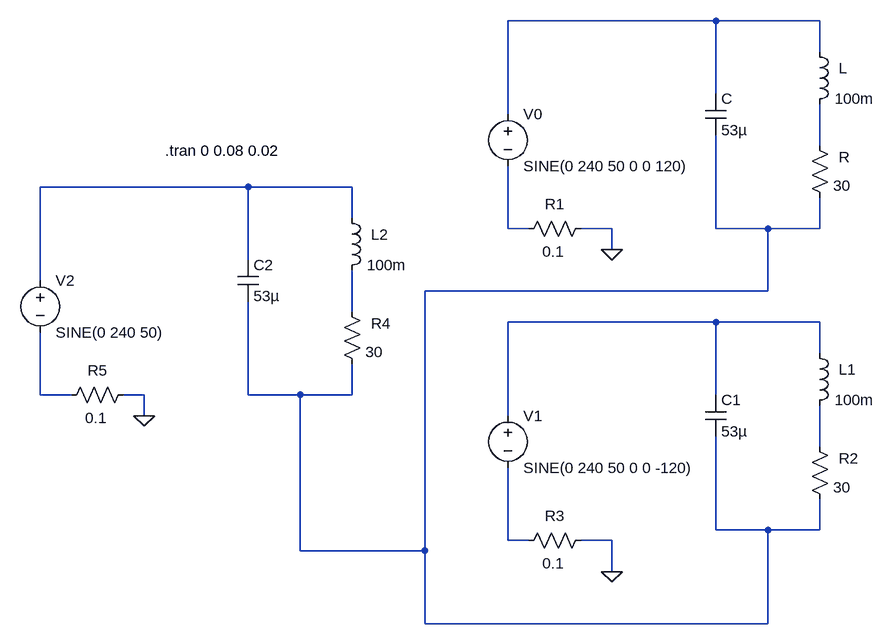
[diagram p0: schematic 3-phase_star_parallel_compensation_capacitor.asc]
3-phase_star_parallel_compensation_capacitor.asc, the LTspice schematic file:
Version 4
SHEET 1 1240 868
WIRE 384 -64 64 -64
WIRE 544 -64 384 -64
WIRE 544 -16 544 -64
WIRE 384 48 384 -64
WIRE 64 80 64 -64
WIRE 544 128 544 64
WIRE -336 192 -656 192
WIRE -176 192 -336 192
WIRE -176 240 -176 192
WIRE 64 256 64 160
WIRE 96 256 64 256
WIRE 224 256 176 256
WIRE 384 256 384 112
WIRE 464 256 384 256
WIRE 544 256 544 208
WIRE 544 256 464 256
WIRE 224 288 224 256
WIRE -336 304 -336 192
WIRE -656 336 -656 192
WIRE 464 352 464 256
WIRE 464 352 -64 352
WIRE -176 384 -176 320
WIRE 384 400 64 400
WIRE 544 400 384 400
WIRE 544 448 544 400
WIRE -656 512 -656 416
WIRE -608 512 -656 512
WIRE -496 512 -528 512
WIRE -336 512 -336 368
WIRE -256 512 -336 512
WIRE -176 512 -176 464
WIRE -176 512 -256 512
WIRE 384 512 384 400
WIRE -496 544 -496 512
WIRE 64 544 64 400
WIRE 544 592 544 528
WIRE 384 720 384 576
WIRE 464 720 384 720
WIRE 544 720 544 672
WIRE 544 720 464 720
WIRE 64 736 64 624
WIRE 96 736 64 736
WIRE 224 736 176 736
WIRE -256 752 -256 512
WIRE -64 752 -64 352
WIRE -64 752 -256 752
WIRE 224 784 224 736
WIRE -64 864 -64 752
WIRE 464 864 464 720
WIRE 464 864 -64 864
FLAG 224 288 0
FLAG 224 784 0
FLAG -496 544 0
SYMBOL voltage 64 64 R0
WINDOW 123 0 0 Left 0
WINDOW 39 0 0 Left 0
SYMATTR InstName V0
SYMATTR Value SINE(0 240 50 0 0 120)
SYMBOL res 528 112 R0
WINDOW 0 45 34 Left 2
WINDOW 3 37 78 Left 2
SYMATTR InstName R
SYMATTR Value 30
SYMBOL ind 528 -32 R0
WINDOW 0 45 41 Left 2
WINDOW 3 39 88 Left 2
SYMATTR InstName L
SYMATTR Value 100m
SYMBOL cap 368 48 R0
SYMATTR InstName C
SYMATTR Value 53µ
SYMBOL res 192 240 R90
WINDOW 0 -6 56 VBottom 2
WINDOW 3 36 58 VTop 2
SYMATTR InstName R1
SYMATTR Value 0.1
SYMBOL voltage 64 528 R0
WINDOW 123 0 0 Left 0
WINDOW 39 0 0 Left 0
SYMATTR InstName V1
SYMATTR Value SINE(0 240 50 0 0 -120)
SYMBOL res 528 576 R0
WINDOW 0 45 34 Left 2
WINDOW 3 37 78 Left 2
SYMATTR InstName R2
SYMATTR Value 30
SYMBOL ind 528 432 R0
WINDOW 0 45 41 Left 2
WINDOW 3 39 88 Left 2
SYMATTR InstName L1
SYMATTR Value 100m
SYMBOL cap 368 512 R0
SYMATTR InstName C1
SYMATTR Value 53µ
SYMBOL res 192 720 R90
WINDOW 0 -6 56 VBottom 2
WINDOW 3 36 58 VTop 2
SYMATTR InstName R3
SYMATTR Value 0.1
SYMBOL voltage -656 320 R0
WINDOW 123 0 0 Left 0
WINDOW 39 0 0 Left 0
SYMATTR InstName V2
SYMATTR Value SINE(0 240 50)
SYMBOL res -192 368 R0
WINDOW 0 45 34 Left 2
WINDOW 3 37 78 Left 2
SYMATTR InstName R4
SYMATTR Value 30
SYMBOL ind -192 224 R0
WINDOW 0 45 41 Left 2
WINDOW 3 39 88 Left 2
SYMATTR InstName L2
SYMATTR Value 100m
SYMBOL cap -352 304 R0
SYMATTR InstName C2
SYMATTR Value 53µ
SYMBOL res -512 496 R90
WINDOW 0 -6 56 VBottom 2
WINDOW 3 36 58 VTop 2
SYMATTR InstName R5
SYMATTR Value 0.1
TEXT -464 136 Left 2 !.tran 0 0.08 0.02

The netlist it stands for:
* 3-phase_star_parallel_compensation_capacitor.asc
V0 N001 N004 SINE(0 240 50 0 0 120)
R N002 N005 30
L N001 N002 100m
C N001 N005 53µ
R1 0 N004 0.1
V1 N007 N010 SINE(0 240 50 0 0 -120)
R2 N009 N005 30
L1 N007 N009 100m
C1 N007 N005 53µ
R3 0 N010 0.1
V2 N003 N008 SINE(0 240 50)
R4 N006 N005 30
L2 N003 N006 100m
C2 N003 N005 53µ
R5 0 N008 0.1
.tran 0 0.08 0.02
.backanno
.end